# Altium schematic sheet io.SchDoc: IMEBUILD V2 ARDUINO CONTROLLER
size A3; Address1: Princeton University; Address2: Princeton NJ 08544; Address3: United States; Revision: B
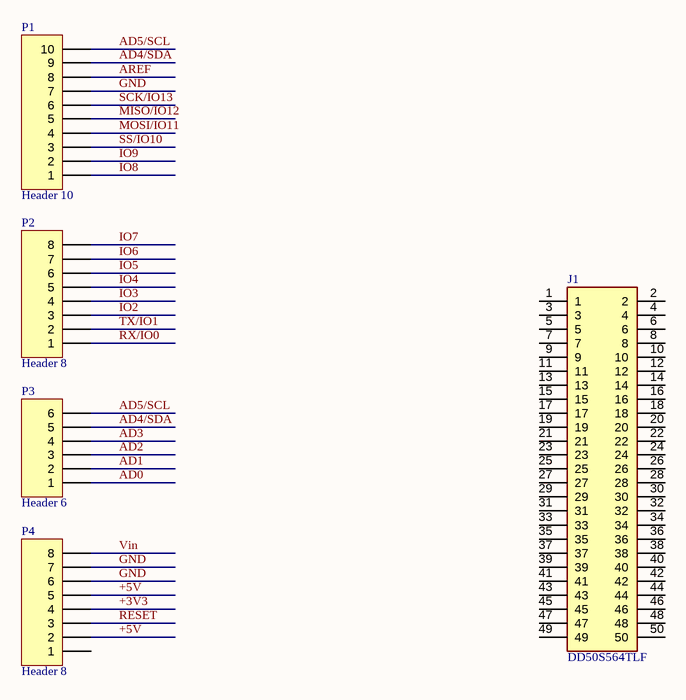
[diagram p0: io.SchDoc]

## Parts
J1  DD50S564TLF  [DD50S564TLF]
P1  Header 10  [HDR1X10]
P2  Header 8  [HDR1X8]
P3  Header 6  [HDR1X6]
P4  Header 8  [HDR1X8]

## Nets
+3V3: P4.4
+5V: P4.2 P4.5
AD0: P3.1
AD1: P3.2
AD2: P3.3
AD3: P3.4
AD4/SDA: P1.9 P3.5
AD5/SCL: P1.10 P3.6
AREF: P1.8
GND: P1.7 P4.6 P4.7
IO2: P2.3
IO3: P2.4
IO4: P2.5
IO5: P2.6
IO6: P2.7
IO7: P2.8
IO8: P1.1
IO9: P1.2
MISO/IO12: P1.5
MOSI/IO11: P1.4
RESET: P4.3
RX/IO0: P2.1
SCK/IO13: P1.6
SS/IO10: P1.3
TX/IO1: P2.2
Vin: P4.8

Not connected (* = marked no-connect by the designer): J1 1 2 3 4 5 6 7 8 9 10 11 12 13 14 15 16 17 18 19 20 21 22 23 24 25 26 27 28 29 30 31 32 33 34 35 36 37 38 39 40 41 42 43 44 45 46 47 48 49 50; P4 1

## Notes on the sheet
- Title
- Date:
- Size:
- A3
- Revision:
- File:
- Sheet
- /

## Library data of the parts
J1 = DD50S564TLF: Connector; Manufacturer_Name: FCI; Allied_Number: 70605931; Datasheet Link: http://docs-emea.rs-online.com/webdocs/0e52/0900766b80e52c42.pdf; Manufacturer_Part_Number: DD50S564TLF; Mouser Part Number: 649-DD50S564TLF; Mouser Price/Stock: https://www.mouser.com/Search/Refine.aspx?Keyword=649-DD50S564TLF; RS Part Number: 1217375; RS Price/Stock: https://uk.rs-online.com/web/p/products/1217375; Allied Price/Stock: http://www.alliedelec.com/amphenol-fci-dd50s564tlf/70605931/; System: Connector
P1 = Header 10: Header, 10-Pin; LatestRevisionDate: 17-Jul-2002; LatestRevisionNote: Re-released for DXP Platform.; Publisher: Altium Limited
P2 P4 = Header 8: Header, 8-Pin; LatestRevisionDate: 17-Jul-2002; LatestRevisionNote: Re-released for DXP Platform.; Publisher: Altium Limited
P3 = Header 6: Header, 6-Pin; LatestRevisionDate: 17-Jul-2002; LatestRevisionNote: Re-released for DXP Platform.; Publisher: Altium Limited